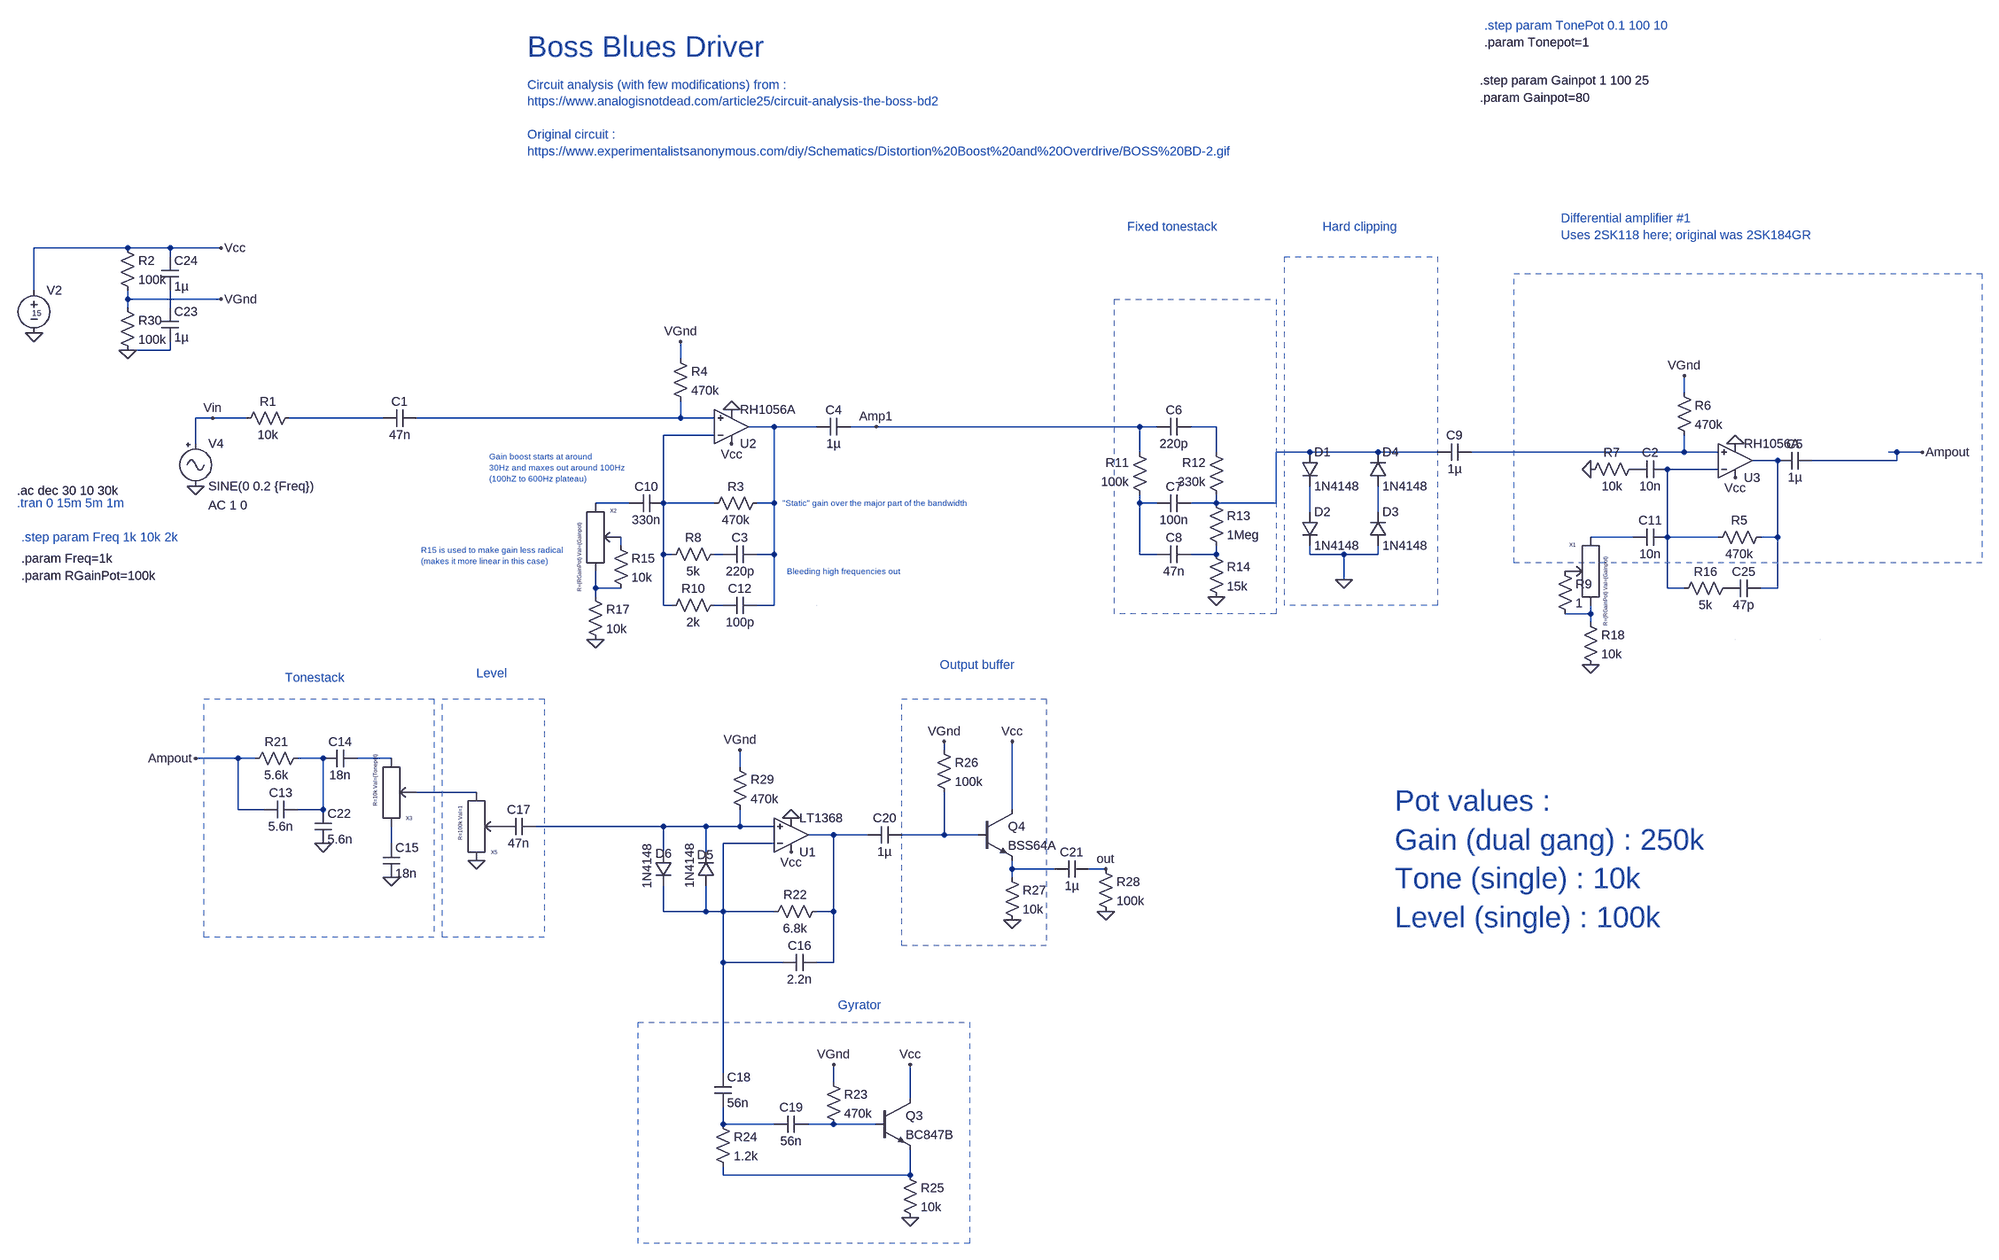
[diagram p0: schematic BossBluesDriver_withOpAmps.asc]
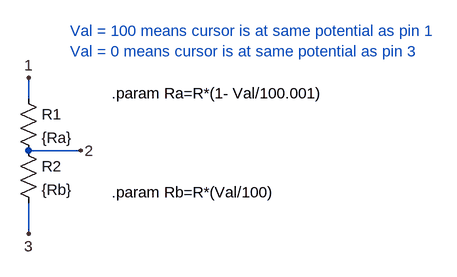
[diagram p1: sub-circuit potentiometer.asc]
BossBluesDriver_withOpAmps.asc, the LTspice schematic file:
Version 4
SHEET 1 4768 1732
WIRE -384 -144 -560 -144
WIRE -304 -144 -384 -144
WIRE -208 -144 -304 -144
WIRE -304 -128 -304 -144
WIRE -560 -64 -560 -144
WIRE -384 -48 -384 -64
WIRE -208 -48 -384 -48
WIRE -384 -32 -384 -48
WIRE -304 -32 -304 -64
WIRE -304 48 -304 32
WIRE -304 48 -384 48
WIRE 656 64 656 32
WIRE 2544 128 2544 96
WIRE -224 176 -256 176
WIRE -160 176 -224 176
WIRE 96 176 -80 176
WIRE 656 176 656 144
WIRE 656 176 160 176
WIRE 720 176 656 176
WIRE 832 192 784 192
WIRE 912 192 832 192
WIRE 1024 192 976 192
WIRE 1520 192 1024 192
WIRE 1552 192 1520 192
WIRE 1664 192 1616 192
WIRE 720 208 624 208
WIRE -256 224 -256 176
WIRE 1520 240 1520 192
WIRE 1664 240 1664 192
WIRE 1840 240 1776 240
WIRE 1968 240 1840 240
WIRE 2080 240 1968 240
WIRE 2544 240 2544 208
WIRE 2544 240 2144 240
WIRE 2608 240 2544 240
WIRE 2944 240 2928 240
WIRE 2992 240 2944 240
WIRE 2720 256 2672 256
WIRE 2944 256 2944 240
WIRE 2944 256 2784 256
WIRE 2608 272 2512 272
WIRE 560 336 496 336
WIRE 624 336 624 208
WIRE 720 336 624 336
WIRE 832 336 832 192
WIRE 832 336 800 336
WIRE 1520 336 1520 320
WIRE 1552 336 1520 336
WIRE 1664 336 1664 320
WIRE 1664 336 1616 336
WIRE 1776 336 1776 240
WIRE 1776 336 1664 336
WIRE 1840 352 1840 304
WIRE 1968 352 1968 304
WIRE 2448 400 2368 400
WIRE 2512 400 2512 272
WIRE 2608 400 2512 400
WIRE 2720 400 2720 256
WIRE 2720 400 2688 400
WIRE 544 416 544 400
WIRE 624 432 624 336
WIRE 640 432 624 432
WIRE 736 432 720 432
WIRE 832 432 832 336
WIRE 832 432 800 432
WIRE 1520 432 1520 336
WIRE 1552 432 1520 432
WIRE 1664 432 1664 416
WIRE 1664 432 1616 432
WIRE 1840 432 1840 416
WIRE 1904 432 1840 432
WIRE 1968 432 1968 416
WIRE 1968 432 1904 432
WIRE 1904 480 1904 432
WIRE 496 496 496 464
WIRE 544 496 496 496
WIRE 2512 496 2512 400
WIRE 2544 496 2512 496
WIRE 2720 496 2720 400
WIRE 2720 496 2688 496
WIRE 496 512 496 496
WIRE 624 528 624 432
WIRE 640 528 624 528
WIRE 736 528 720 528
WIRE 832 528 832 432
WIRE 832 528 800 528
WIRE 2368 544 2368 528
WIRE 2368 544 2320 544
WIRE 2368 560 2368 544
WIRE 1152 800 1152 784
WIRE -176 816 -256 816
WIRE -144 816 -176 816
WIRE -16 816 -64 816
WIRE 112 816 48 816
WIRE 768 832 768 800
WIRE 272 880 160 880
WIRE -176 912 -176 816
WIRE -128 912 -176 912
WIRE -16 912 -16 816
WIRE -16 912 -64 912
WIRE 1280 912 1280 784
WIRE 624 944 384 944
WIRE 704 944 624 944
WIRE 768 944 768 912
WIRE 768 944 704 944
WIRE 832 944 768 944
WIRE 944 960 896 960
WIRE 1008 960 944 960
WIRE 1152 960 1152 880
WIRE 1152 960 1072 960
WIRE 1216 960 1152 960
WIRE 112 976 112 944
WIRE 832 976 736 976
WIRE 624 992 624 944
WIRE 704 992 704 944
WIRE 1280 1024 1280 1008
WIRE 1360 1024 1280 1024
WIRE 1456 1024 1424 1024
WIRE 1280 1040 1280 1024
WIRE 624 1104 624 1056
WIRE 704 1104 704 1056
WIRE 704 1104 624 1104
WIRE 736 1104 736 976
WIRE 736 1104 704 1104
WIRE 832 1104 736 1104
WIRE 944 1104 944 960
WIRE 944 1104 912 1104
WIRE 736 1200 736 1104
WIRE 848 1200 736 1200
WIRE 944 1200 944 1104
WIRE 944 1200 912 1200
WIRE 736 1408 736 1200
WIRE 944 1424 944 1392
WIRE 1088 1456 1088 1392
WIRE 736 1504 736 1472
WIRE 832 1504 736 1504
WIRE 944 1504 896 1504
WIRE 1024 1504 944 1504
WIRE 736 1600 736 1584
WIRE 1088 1600 1088 1552
WIRE 1088 1600 736 1600
FLAG -560 16 0
FLAG -208 -48 VGnd
FLAG -208 -144 Vcc
FLAG -256 304 0
FLAG -224 176 Vin
FLAG 1664 512 0
FLAG 1904 480 0
FLAG 2992 240 Ampout
FLAG -256 816 Ampout
FLAG 112 1040 0
FLAG 272 1008 0
FLAG 1088 1680 0
FLAG 864 928 0
FLAG 864 992 Vcc
FLAG 1280 1120 0
FLAG 1280 784 Vcc
FLAG 1456 1104 0
FLAG -16 976 0
FLAG 1456 1024 out
FLAG -384 48 0
FLAG 768 800 VGnd
FLAG 1152 784 VGnd
FLAG 944 1392 VGnd
FLAG 1088 1392 Vcc
FLAG 752 160 0
FLAG 752 224 Vcc
FLAG 656 32 VGnd
FLAG 2640 224 0
FLAG 2640 288 Vcc
FLAG 2544 96 VGnd
FLAG 496 592 0
FLAG 2368 640 0
FLAG 1024 192 Amp1
FLAG 2368 272 0
SYMBOL voltage -560 -80 R0
WINDOW 123 0 0 Left 0
WINDOW 39 0 0 Left 0
WINDOW 3 -4 58 Left 1
SYMATTR Value 15
SYMATTR InstName V2
SYMBOL Misc\\signal -256 208 R0
WINDOW 123 24 132 Left 2
WINDOW 39 0 0 Left 0
SYMATTR Value2 AC 1 0
SYMATTR InstName V4
SYMATTR Value SINE(0 0.2 {Freq})
SYMBOL cap 160 160 R90
WINDOW 0 0 32 VBottom 2
WINDOW 3 32 32 VTop 2
SYMATTR InstName C1
SYMATTR Value 47n
SYMBOL cap 1616 176 R90
WINDOW 0 0 32 VBottom 2
WINDOW 3 32 32 VTop 2
SYMATTR InstName C6
SYMATTR Value 220p
SYMBOL res 1536 336 R180
WINDOW 0 36 76 Left 2
WINDOW 3 36 40 Left 2
SYMATTR InstName R11
SYMATTR Value 100k
SYMBOL res 1680 336 R180
WINDOW 0 36 76 Left 2
WINDOW 3 36 40 Left 2
SYMATTR InstName R12
SYMATTR Value 330k
SYMBOL cap 1616 320 R90
WINDOW 0 0 32 VBottom 2
WINDOW 3 32 32 VTop 2
SYMATTR InstName C7
SYMATTR Value 100n
SYMBOL cap 1616 416 R90
WINDOW 0 0 32 VBottom 2
WINDOW 3 32 32 VTop 2
SYMATTR InstName C8
SYMATTR Value 47n
SYMBOL res 1648 320 R0
SYMATTR InstName R13
SYMATTR Value 1Meg
SYMBOL res 1648 416 R0
SYMATTR InstName R14
SYMATTR Value 15k
SYMBOL diode 1824 240 R0
SYMATTR InstName D1
SYMATTR Value 1N4148
SYMBOL diode 1824 352 R0
SYMATTR InstName D2
SYMATTR Value 1N4148
SYMBOL diode 1952 416 M180
WINDOW 0 24 64 Left 2
WINDOW 3 24 0 Left 2
SYMATTR InstName D3
SYMATTR Value 1N4148
SYMBOL diode 1952 304 M180
WINDOW 0 24 64 Left 2
WINDOW 3 24 0 Left 2
SYMATTR InstName D4
SYMATTR Value 1N4148
SYMBOL cap 2144 224 R90
WINDOW 0 0 32 VBottom 2
WINDOW 3 32 32 VTop 2
SYMATTR InstName C9
SYMATTR Value 1µ
SYMBOL Potentiometer 496 400 R0
WINDOW 39 -29 -26 VRight 0
SYMATTR SpiceLine R={RGainPot} Val={Gainpot}
SYMATTR InstName X2
SYMBOL res -48 800 R90
WINDOW 0 0 56 VBottom 2
WINDOW 3 32 56 VTop 2
SYMATTR InstName R21
SYMATTR Value 5.6k
SYMBOL cap -64 896 R90
WINDOW 0 0 32 VBottom 2
WINDOW 3 32 32 VTop 2
SYMATTR InstName C13
SYMATTR Value 5.6n
SYMBOL cap 48 800 R90
WINDOW 0 0 32 VBottom 2
WINDOW 3 32 32 VTop 2
SYMATTR InstName C14
SYMATTR Value 18n
SYMBOL Potentiometer 112 880 M180
WINDOW 39 -29 -26 VRight 0
SYMATTR SpiceLine R=10k Val={Tonepot}
SYMATTR InstName X3
SYMBOL cap 96 976 R0
SYMATTR InstName C15
SYMATTR Value 18n
SYMBOL Potentiometer 272 944 M180
WINDOW 39 -29 -26 VRight 0
SYMATTR SpiceLine R=100k Val=1
SYMATTR InstName X5
SYMBOL cap 384 928 R90
WINDOW 0 0 32 VBottom 2
WINDOW 3 32 32 VTop 2
SYMATTR InstName C17
SYMATTR Value 47n
SYMBOL diode 720 1056 R180
WINDOW 0 2 59 Left 2
WINDOW 3 126 -5 VRight 2
SYMATTR InstName D5
SYMATTR Value 1N4148
SYMBOL diode 608 992 R0
WINDOW 0 1 3 Left 2
WINDOW 3 66 68 VLeft 2
SYMATTR InstName D6
SYMATTR Value 1N4148
SYMBOL res 928 1088 R90
WINDOW 0 0 56 VBottom 2
WINDOW 3 32 56 VTop 2
SYMATTR InstName R22
SYMATTR Value 6.8k
SYMBOL cap 912 1184 R90
WINDOW 0 0 32 VBottom 2
WINDOW 3 32 32 VTop 2
SYMATTR InstName C16
SYMATTR Value 2.2n
SYMBOL cap 720 1408 R0
SYMATTR InstName C18
SYMATTR Value 56n
SYMBOL cap 896 1488 R90
WINDOW 0 0 32 VBottom 2
WINDOW 3 32 32 VTop 2
SYMATTR InstName C19
SYMATTR Value 56n
SYMBOL res 928 1408 R0
SYMATTR InstName R23
SYMATTR Value 470k
SYMBOL npn 1024 1456 R0
SYMATTR InstName Q3
SYMATTR Value BC847B
SYMBOL res 720 1488 R0
SYMATTR InstName R24
SYMATTR Value 1.2k
SYMBOL res 1072 1584 R0
SYMATTR InstName R25
SYMATTR Value 10k
SYMBOL cap 1072 944 R90
WINDOW 0 0 32 VBottom 2
WINDOW 3 32 32 VTop 2
SYMATTR InstName C20
SYMATTR Value 1µ
SYMBOL res 1136 784 R0
SYMATTR InstName R26
SYMATTR Value 100k
SYMBOL npn 1216 912 R0
SYMATTR InstName Q4
SYMATTR Value BSS64A
SYMBOL res 1264 1024 R0
SYMATTR InstName R27
SYMATTR Value 10k
SYMBOL cap 1424 1008 R90
WINDOW 0 0 32 VBottom 2
WINDOW 3 32 32 VTop 2
SYMATTR InstName C21
SYMATTR Value 1µ
SYMBOL res 1440 1008 R0
SYMATTR InstName R28
SYMATTR Value 100k
SYMBOL res 752 816 R0
SYMATTR InstName R29
SYMATTR Value 470k
SYMBOL cap -32 912 R0
SYMATTR InstName C22
SYMATTR Value 5.6n
SYMBOL res -64 160 R90
WINDOW 0 0 56 VBottom 2
WINDOW 3 32 56 VTop 2
SYMATTR InstName R1
SYMATTR Value 10k
SYMBOL OpAmps\\LT1368 864 1024 M180
SYMATTR InstName U1
SYMBOL res -400 -160 R0
SYMATTR InstName R2
SYMATTR Value 100k
SYMBOL res -400 -48 R0
SYMATTR InstName R30
SYMATTR Value 100k
SYMBOL cap -320 -32 R0
SYMATTR InstName C23
SYMATTR Value 1µ
SYMBOL cap -320 -128 R0
SYMATTR InstName C24
SYMATTR Value 1µ
SYMBOL res 816 320 R90
WINDOW 0 0 56 VBottom 2
WINDOW 3 32 56 VTop 2
SYMATTR InstName R3
SYMATTR Value 470k
SYMBOL res 640 48 R0
SYMATTR InstName R4
SYMATTR Value 470k
SYMBOL cap 976 176 R90
WINDOW 0 0 32 VBottom 2
WINDOW 3 32 32 VTop 2
SYMATTR InstName C4
SYMATTR Value 1µ
SYMBOL cap 2784 240 R90
WINDOW 0 0 32 VBottom 2
WINDOW 3 32 32 VTop 2
SYMATTR InstName C5
SYMATTR Value 1µ
SYMBOL OpAmps\\RH1056A 752 256 M180
SYMATTR InstName U2
SYMBOL cap 624 320 R90
WINDOW 0 0 32 VBottom 2
WINDOW 3 32 32 VTop 2
SYMATTR InstName C10
SYMATTR Value 330n
SYMBOL res 2704 384 R90
WINDOW 0 0 56 VBottom 2
WINDOW 3 32 56 VTop 2
SYMATTR InstName R5
SYMATTR Value 470k
SYMBOL res 2528 112 R0
SYMATTR InstName R6
SYMATTR Value 470k
SYMBOL OpAmps\\RH1056A 2640 320 M180
SYMATTR InstName U3
SYMBOL Potentiometer 2368 464 M0
WINDOW 39 -29 -26 VRight 0
SYMATTR SpiceLine R={RGainPot} Val={Gainpot}
SYMATTR InstName X1
SYMBOL cap 2512 384 R90
WINDOW 0 0 32 VBottom 2
WINDOW 3 32 32 VTop 2
SYMATTR InstName C11
SYMATTR Value 10n
SYMBOL cap 800 416 R90
WINDOW 0 0 32 VBottom 2
WINDOW 3 32 32 VTop 2
SYMATTR InstName C3
SYMATTR Value 220p
SYMBOL res 2304 448 R0
SYMATTR InstName R9
SYMATTR Value 1
SYMBOL res 736 416 R90
WINDOW 0 0 56 VBottom 2
WINDOW 3 32 56 VTop 2
SYMATTR InstName R8
SYMATTR Value 5k
SYMBOL cap 800 512 R90
WINDOW 0 0 32 VBottom 2
WINDOW 3 32 32 VTop 2
SYMATTR InstName C12
SYMATTR Value 100p
SYMBOL res 736 512 R90
WINDOW 0 0 56 VBottom 2
WINDOW 3 32 56 VTop 2
SYMATTR InstName R10
SYMATTR Value 2k
SYMBOL res 528 400 R0
SYMATTR InstName R15
SYMATTR Value 10k
SYMBOL cap 2512 256 R90
WINDOW 0 0 32 VBottom 2
WINDOW 3 32 32 VTop 2
SYMATTR InstName C2
SYMATTR Value 10n
SYMBOL res 2464 256 R90
WINDOW 0 0 56 VBottom 2
WINDOW 3 32 56 VTop 2
SYMATTR InstName R7
SYMATTR Value 10k
SYMBOL cap 2688 480 R90
WINDOW 0 0 32 VBottom 2
WINDOW 3 32 32 VTop 2
SYMATTR InstName C25
SYMATTR Value 47p
SYMBOL res 2640 480 R90
WINDOW 0 0 56 VBottom 2
WINDOW 3 32 56 VTop 2
SYMATTR InstName R16
SYMATTR Value 5k
SYMBOL res 480 496 R0
SYMATTR InstName R17
SYMATTR Value 10k
SYMBOL res 2352 544 R0
SYMATTR InstName R18
SYMATTR Value 10k
TEXT -592 336 Left 2 ;.tran 0 15m 5m 1m
TEXT 2160 -544 Left 2 !.step param Gainpot 1 100 25
TEXT 2160 -512 Left 2 !.param Gainpot=80
TEXT -584 400 Left 2 ;.step param Freq 1k 10k 2k
TEXT -584 440 Left 2 !.param Freq=1k
TEXT 368 -608 Left 5 ;Boss Blues Driver
TEXT -592 312 Left 2 !.ac dec 30 10 30k
TEXT 2168 -648 Left 2 ;.step param TonePot 0.1 100 10
TEXT 2168 -616 Left 2 !.param Tonepot=1
TEXT 368 -536 Left 2 ;Circuit analysis (with few modifications) from :\nhttps://www.analogisnotdead.com/article25/circuit-analysis-the-boss-bd2 \n \nOriginal circuit :\nhttps://www.experimentalistsanonymous.com/diy/Schematics/Distortion%20Boost%20and%20Overdrive/BOSS%20BD-2.gif
TEXT 2312 -200 Left 2 ;Differential amplifier #1\nUses 2SK118 here; original was 2SK184GR
TEXT 1864 -184 Left 2 ;Hard clipping
TEXT 1496 -184 Left 2 ;Fixed tonestack
TEXT -88 664 Left 2 ;Tonestack
TEXT 272 656 Left 2 ;Level
TEXT 952 1280 Left 2 ;Gyrator
TEXT 1144 640 Left 2 ;Output buffer
TEXT 2000 896 Left 5 ;Pot values : \nGain (dual gang) : 250k\nTone (single) : 10k\nLevel (single) : 100k
TEXT -584 472 Left 2 !.param RGainPot=100k
TEXT 848 336 Left 1 ;"Static" gain over the major part of the bandwidth
TEXT 856 464 Left 1 ;Bleeding high frequencies out
TEXT 168 424 Left 1 ;R15 is used to make gain less radical\n(makes it more linear in this case)
TEXT 296 248 Left 1 ;Gain boost starts at around \n30Hz and maxes out around 100Hz\n(100hZ to 600Hz plateau)
LINE Normal 912 528 912 528 2
LINE Normal 2640 592 2640 592 2
LINE Normal 2800 592 2800 592 2
RECTANGLE Normal 1776 544 1472 -48 2
RECTANGLE Normal 3104 448 2224 -96 2
RECTANGLE Normal 2080 528 1792 -128 2
RECTANGLE Normal 192 1152 -240 704 2
RECTANGLE Normal 400 1152 208 704 2
RECTANGLE Normal 1200 1728 576 1312 2
RECTANGLE Normal 1344 1168 1072 704 2

potentiometer.asc, the sub-circuit schematic file:
Version 4
SHEET 1 908 680
WIRE 192 96 192 64
WIRE 272 176 192 176
WIRE 192 304 192 256
FLAG 192 64 1
FLAG 272 176 2
FLAG 192 304 3
SYMBOL res 176 80 R0
SYMATTR InstName R1
SYMATTR Value {Ra}
SYMBOL res 176 160 R0
SYMATTR InstName R2
SYMATTR Value {Rb}
TEXT 320 88 Left 2 !.param Ra=R*(1- Val/100.001)
TEXT 320 240 Left 2 !.param Rb=R*(Val/100)
TEXT 256 -8 Left 2 ;Val = 100 means cursor is at same potential as pin 1\nVal = 0 means cursor is at same potential as pin 3

The netlist it stands for:
* BossBluesDriver_withOpAmps.asc
V2 Vcc 0 15
V4 Vin 0 SINE(0 0.2 {Freq}) AC 1 0
C1 N003 N002 47n
C6 N005 Amp1 220p
R11 N012 Amp1 100k
R12 N007 N005 330k
C7 N007 N012 100n
C8 N018 N012 47n
R13 N007 N018 1Meg
R14 N018 0 15k
D1 N007 N013 1N4148
D2 N013 0 1N4148
D3 0 N014 1N4148
D4 N014 N007 1N4148
C9 N008 N007 1µ
XX2 N011 N016 N019 potentiometer params: R={RGainPot} Val={Gainpot}
R21 N022 Ampout 5.6k
C13 N022 Ampout 5.6n
C14 N023 N022 18n
XX3 N028 N024 N023 potentiometer params: R=10k Val={Tonepot}
C15 N028 0 18n
XX5 0 P001 N024 potentiometer params: R=100k Val=1
C17 N025 P001 47n
D5 N029 N025 1N4148
D6 N025 N029 1N4148
R22 N026 N029 6.8k
C16 N026 N029 2.2n
C18 N029 N031 56n
C19 N032 N031 56n
R23 VGnd N032 470k
Q3 Vcc N032 N033 0 BC847B
R24 N031 N033 1.2k
R25 N033 0 10k
C20 N027 N026 1µ
R26 VGnd N027 100k
Q4 Vcc N027 N030 0 BSS64A
R27 N030 0 10k
C21 out N030 1µ
R28 out 0 100k
R29 VGnd N025 470k
C22 N022 0 5.6n
R1 N002 Vin 10k
XU1 N025 N029 Vcc 0 N026 LT1368  ; pins In+ In- V+ V- OUT
R2 Vcc VGnd 100k
R30 VGnd 0 100k
C23 N001 0 1µ
C24 Vcc N001 1µ
R3 N004 N006 470k
R4 VGnd N003 470k
C4 Amp1 N004 1µ
C5 Ampout N009 1µ
XU2 N003 N006 Vcc 0 N004 RH1056A  ; pins In+ In- V+ V- OUT
C10 N006 N011 330n
R5 N009 N010 470k
R6 VGnd N008 470k
XU3 N008 N010 Vcc 0 N009 RH1056A  ; pins In+ In- V+ V- OUT
XX1 N015 P002 N021 potentiometer params: R={RGainPot} Val={Gainpot}
C11 N010 N015 10n
C3 N004 N017 220p
R9 P002 N021 1
R8 N017 N006 5k
C12 N004 N020 100p
R10 N020 N006 2k
R15 N016 N019 10k
C2 N010 P003 10n
R7 P003 0 10k
C25 N009 P004 47p
R16 P004 N010 5k
R17 N019 0 10k
R18 N021 0 10k

* block symbol definitions
.subckt potentiometer 1 2 3
R1 1 2 {Ra}
R2 2 3 {Rb}
.param Ra=R*(1- Val/100.001)
.param Rb=R*(Val/100)
* Val = 100 means cursor is at same potential as pin 1
* Val = 0 means cursor is at same potential as pin 3
.ends potentiometer

.model D D
.lib standard.dio
.model NPN NPN
.model PNP PNP
.lib standard.bjt
* .tran 0 15m 5m 1m
.step param Gainpot 1 100 25
.param Gainpot=80
* .step param Freq 1k 10k 2k
.param Freq=1k
* Boss Blues Driver
.ac dec 30 10 30k
* .step param TonePot 0.1 100 10
.param Tonepot=1
* Circuit analysis (with few modifications) from :
* https://www.analogisnotdead.com/article25/circuit-analysis-the-boss-bd2
* Original circuit :
* https://www.experimentalistsanonymous.com/diy/Schematics/Distortion%20Boost%20and%20Overdrive/BOSS%20BD-2.gif
* Differential amplifier #1
* Uses 2SK118 here; original was 2SK184GR
* Hard clipping
* Fixed tonestack
* Tonestack
* Level
* Gyrator
* Output buffer
* Pot values :
* Gain (dual gang) : 250k
* Tone (single) : 10k
* Level (single) : 100k
.param RGainPot=100k
* "Static" gain over the major part of the bandwidth
* Bleeding high frequencies out
* R15 is used to make gain less radical
* (makes it more linear in this case)
* Gain boost starts at around
* 30Hz and maxes out around 100Hz
* (100hZ to 600Hz plateau)
.backanno
.end